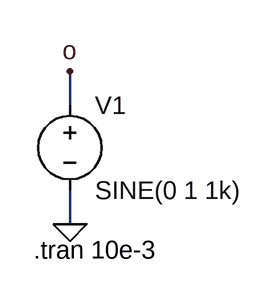
[diagram p0: schematic Draft20.asc]
Draft20.asc, the LTspice schematic file:
Version 4
SHEET 1 880 680
WIRE 128 112 128 80
WIRE 128 224 128 192
FLAG 128 224 0
FLAG 128 80 o
SYMBOL voltage 128 96 R0
WINDOW 123 0 0 Left 2
WINDOW 39 0 0 Left 2
SYMATTR InstName V1
SYMATTR Value SINE(0 1 1k)
TEXT 94 248 Left 2 !.tran 10e-3

The netlist it stands for:
* Draft20.asc
V1 o 0 SINE(0 1 1k)
.tran 10e-3
.backanno
.end